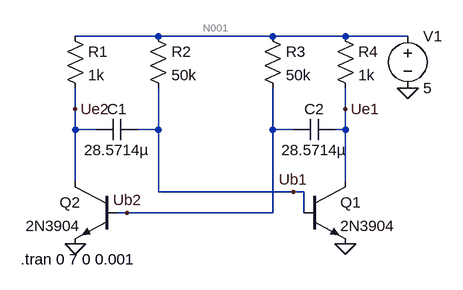
[diagram p0: schematic Lab4.asc]
Lab4.asc, the LTspice schematic file:
Version 4
SHEET 1 880 680
WIRE -64 112 -192 112
WIRE 112 112 -64 112
WIRE 224 112 112 112
WIRE 320 112 224 112
WIRE -192 224 -192 192
WIRE 224 224 224 192
WIRE -192 256 -192 224
WIRE -160 256 -192 256
WIRE -64 256 -64 192
WIRE -64 256 -96 256
WIRE 112 256 112 192
WIRE 144 256 112 256
WIRE 224 256 224 224
WIRE 224 256 208 256
WIRE -192 336 -192 256
WIRE 224 336 224 256
WIRE -64 352 -64 256
WIRE 144 352 -64 352
WIRE 160 352 144 352
WIRE -112 384 -128 384
WIRE 112 384 112 256
WIRE 112 384 -112 384
WIRE 160 384 160 352
FLAG 320 192 0
FLAG 224 432 0
FLAG -192 432 0
FLAG 144 352 Ub1
FLAG -112 384 Ub2
FLAG 224 224 Ue1
FLAG -192 224 Ue2
SYMBOL voltage 320 96 R0
WINDOW 123 0 0 Left 0
WINDOW 39 0 0 Left 0
SYMATTR InstName V1
SYMATTR Value 5
SYMBOL res -208 96 R0
SYMATTR InstName R1
SYMATTR Value 1k
SYMBOL res -80 96 R0
SYMATTR InstName R2
SYMATTR Value 50k
SYMBOL res 96 96 R0
SYMATTR InstName R3
SYMATTR Value 50k
SYMBOL res 208 96 R0
SYMATTR InstName R4
SYMATTR Value 1k
SYMBOL cap -96 240 R90
WINDOW 0 0 32 VBottom 2
WINDOW 3 32 32 VTop 2
SYMATTR InstName C1
SYMATTR Value 28.5714µ
SYMBOL cap 208 240 R90
WINDOW 0 0 32 VBottom 2
WINDOW 3 32 32 VTop 2
SYMATTR InstName C2
SYMATTR Value 28.5714µ
SYMBOL npn 160 336 R0
SYMATTR InstName Q1
SYMATTR Value 2N3904
SYMBOL npn -128 336 M0
SYMATTR InstName Q2
SYMATTR Value 2N3904
TEXT -276 456 Left 2 !.tran 0 7 0 0.001

The netlist it stands for:
* Lab4.asc
V1 N001 0 5
R1 N001 Ue2 1k
R2 N001 Ub1 50k
R3 N001 Ub2 50k
R4 N001 Ue1 1k
C1 Ub1 Ue2 28.5714µ
C2 Ue1 Ub2 28.5714µ
Q1 Ue1 Ub1 0 0 2N3904
Q2 Ue2 Ub2 0 0 2N3904
.model NPN NPN
.model PNP PNP
.lib standard.bjt
.tran 0 7 0 0.001
.backanno
.end

* Results of the author's LTspice run, read from the files saved beside the schematic
* Operating Point, zero values left out:
*   V(n001) = 5 V
*   V(ue2) = 78.05 mV
*   V(ub1) = 700.8 mV
*   V(ub2) = 700.8 mV
*   V(ue1) = 78.05 mV
*   Ic(Q2) = 4.922 mA
*   Ib(Q2) = 85.98 µA
*   Ie(Q2) = -5.008 mA
*   Ic(Q1) = 4.922 mA
*   Ib(Q1) = 85.98 µA
*   Ie(Q1) = -5.008 mA
*   I(R4) = 4.922 mA
*   I(R3) = 85.98 µA
*   I(R2) = 85.98 µA
*   I(R1) = 4.922 mA
*   I(V1) = -10.02 mA
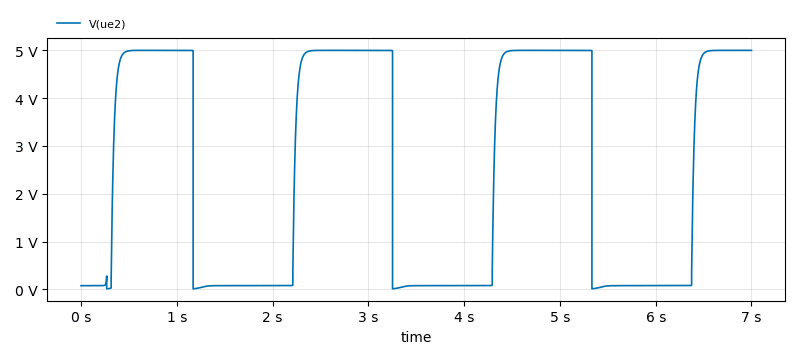
[diagram p1: Transient Analysis of Lab4.asc, plotted from the saved traces]
* Transient Analysis, 1 run:
*   V(ue2): min 12.94 mV, max 5 V, average 2.501 V, rms 3.482 V, last 5 V